# EAGLE design sma-test-20190912a (EAGLE 9.5.0)
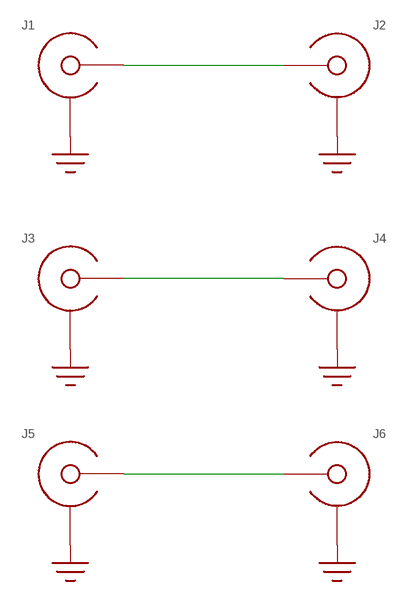
[diagram p0: schematic, sheet 1]

## Parts
J1  SMA-EDGE-LAUNCH4020N  [SMA_EDGE_LAUNCH_4L_4020_N]
J2  SMA-EDGE-LAUNCH4020N1  [SMA_EDGE_LAUNCH_4L_4020_N1]
J3  SMA-EDGE-LAUNCH4020N2  [SMA_EDGE_LAUNCH_4L_4020_N2]
J4  SMA-EDGE-LAUNCH4020N3  [SMA_EDGE_LAUNCH_4L_4020_N3]
J5  SMA-EDGE-LAUNCH4020N4  [SMA_EDGE_LAUNCH_4L_4020_N4]
J6  SMA-EDGE-LAUNCH4L-4020-TAPER-FIXED  [SMA_EDGE_LAUNCH_4L_4020_TAPER_FIXED]

## Nets
GND: J1.BOTTOM_GND(SHIELD) J1.GND@1(SHIELD) J1.GND@2(SHIELD) J1.GND@3(SHIELD) J1.GND@4(SHIELD) J1.GND@5(SHIELD) J1.GND@6(SHIELD) J1.GND@7(SHIELD) J1.GND@8(SHIELD) J1.GND@14(SHIELD) J1.GND@15(SHIELD) J1.GND@16(SHIELD) J1.GND@17(SHIELD) J1.GND_PAD1(SHIELD) J1.GND_PAD2(SHIELD) J1.P$1(SHIELD) J1.P$2(SHIELD) J2.BOTTOM_GND(SHIELD) J2.GND@1(SHIELD) J2.GND@2(SHIELD) J2.GND@3(SHIELD) J2.GND@4(SHIELD) J2.GND@5(SHIELD) J2.GND@6(SHIELD) J2.GND@7(SHIELD) J2.GND@8(SHIELD) J2.GND@14(SHIELD) J2.GND@15(SHIELD) J2.GND@16(SHIELD) J2.GND@17(SHIELD) J2.GND_PAD1(SHIELD) J2.GND_PAD2(SHIELD) J2.P$1(SHIELD) J2.P$2(SHIELD) J2.P$3(SHIELD) J2.P$4(SHIELD) J2.P$5(SHIELD) J3.BOTTOM_GND(SHIELD) J3.GND@1(SHIELD) J3.GND@2(SHIELD) J3.GND@3(SHIELD) J3.GND@4(SHIELD) J3.GND@5(SHIELD) J3.GND@6(SHIELD) J3.GND@7(SHIELD) J3.GND@8(SHIELD) J3.GND@14(SHIELD) J3.GND@15(SHIELD) J3.GND@16(SHIELD) J3.GND@17(SHIELD) J3.GND_PAD1(SHIELD) J3.GND_PAD2(SHIELD) J3.P$1(SHIELD) J3.P$2(SHIELD) J4.BOTTOM_GND(SHIELD) J4.GND@1(SHIELD) J4.GND@2(SHIELD) J4.GND@3(SHIELD) J4.GND@4(SHIELD) J4.GND@5(SHIELD) J4.GND@6(SHIELD) J4.GND@7(SHIELD) J4.GND@8(SHIELD) J4.GND@14(SHIELD) J4.GND@15(SHIELD) J4.GND@16(SHIELD) J4.GND@17(SHIELD) J4.GND_PAD1(SHIELD) J4.GND_PAD2(SHIELD) J4.P$1(SHIELD) J4.P$2(SHIELD) J4.P$3(SHIELD) J4.P$4(SHIELD) J5.BOTTOM_GND(SHIELD) J5.GND@1(SHIELD) J5.GND@2(SHIELD) J5.GND@3(SHIELD) J5.GND@4(SHIELD) J5.GND@5(SHIELD) J5.GND@6(SHIELD) J5.GND@7(SHIELD) J5.GND@8(SHIELD) J5.GND@9(SHIELD) J5.GND@10(SHIELD) J5.GND@14(SHIELD) J5.GND@15(SHIELD) J5.GND@16(SHIELD) J5.GND@17(SHIELD) J5.GND_PAD1(SHIELD) J5.GND_PAD2(SHIELD) J5.P$1(SHIELD) J5.P$2(SHIELD) J5.P$3(SHIELD) J5.P$4(SHIELD) J5.P$5(SHIELD) J6.BOTTOM_GND(SHIELD) J6.GND@1(SHIELD) J6.GND@2(SHIELD) J6.GND@3(SHIELD) J6.GND@4(SHIELD) J6.GND@5(SHIELD) J6.GND@6(SHIELD) J6.GND@7(SHIELD) J6.GND@8(SHIELD) J6.GND@14(SHIELD) J6.GND@15(SHIELD) J6.GND@16(SHIELD) J6.GND@17(SHIELD) J6.GND_PAD1(SHIELD) J6.GND_PAD2(SHIELD) J6.P$1(SHIELD) J6.P$2(SHIELD)
N$1 [13.4-6]: J1.CENTER@1(CENTER) J1.CENTER@2(CENTER) J2.CENTER@1(CENTER) J2.CENTER@2(CENTER)
N$2 [13.4-6]: J3.CENTER@1(CENTER) J3.CENTER@2(CENTER) J4.CENTER@1(CENTER) J4.CENTER@2(CENTER)
N$3 [13.4-6]: J5.CENTER@1(CENTER) J5.CENTER@2(CENTER) J6.CENTER@1(CENTER) J6.P$3(CENTER)

## Library data of the parts
J1-J6 = sma-temp:SMA-EDGE-LAUNCH

## Net classes
1 13.4-6: width 0.34 mm, clearance 0.152 mm

## Board
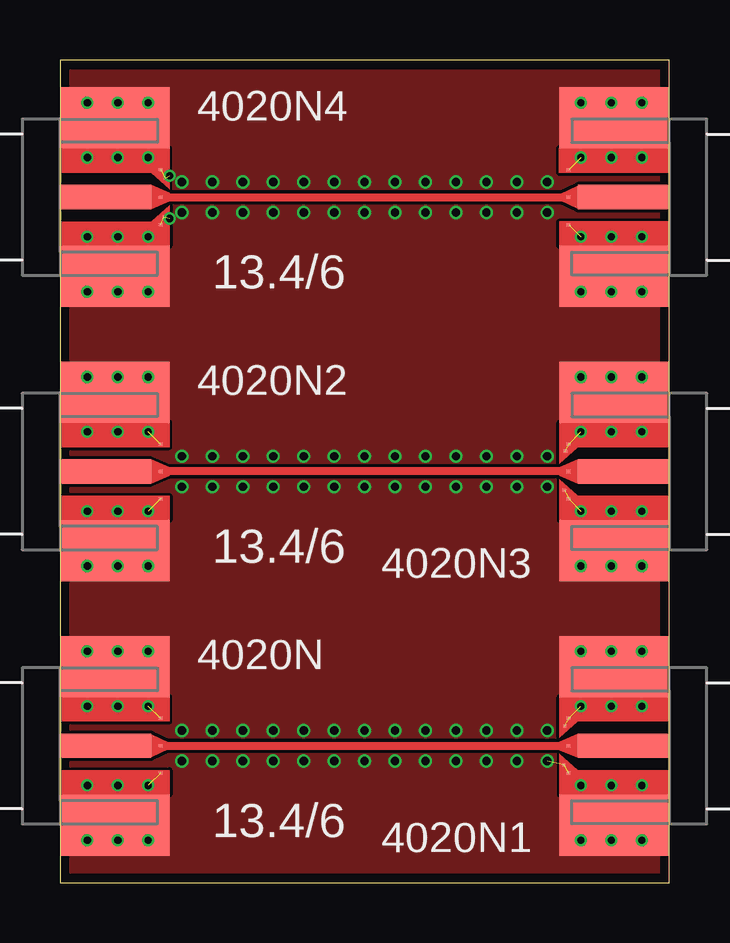
[diagram p1: board, top side]
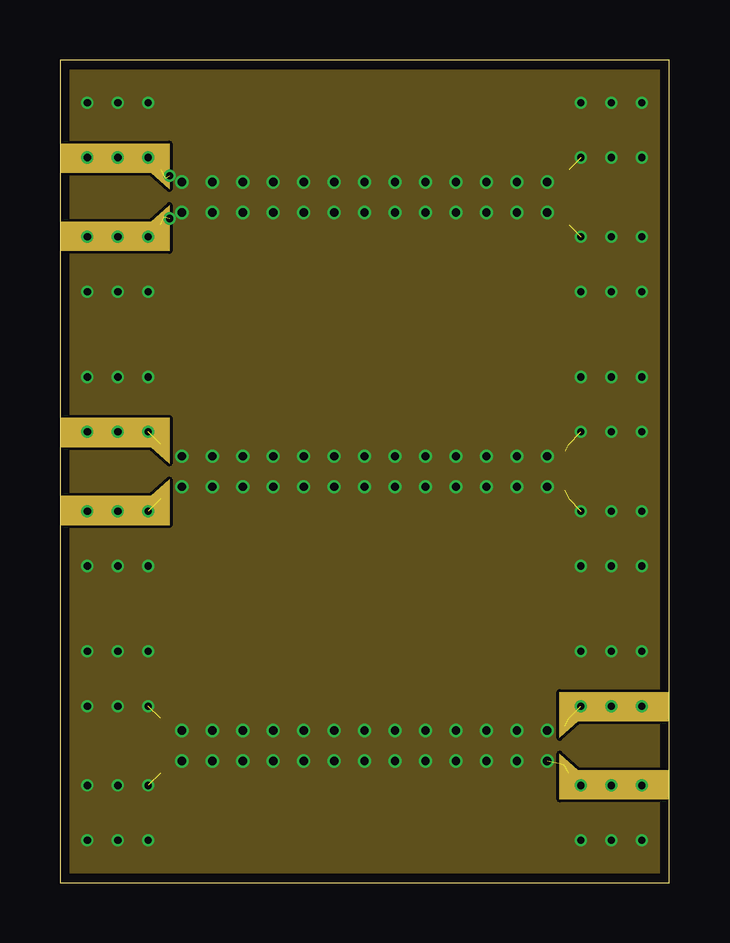
[diagram p2: board, inner layer Route2]
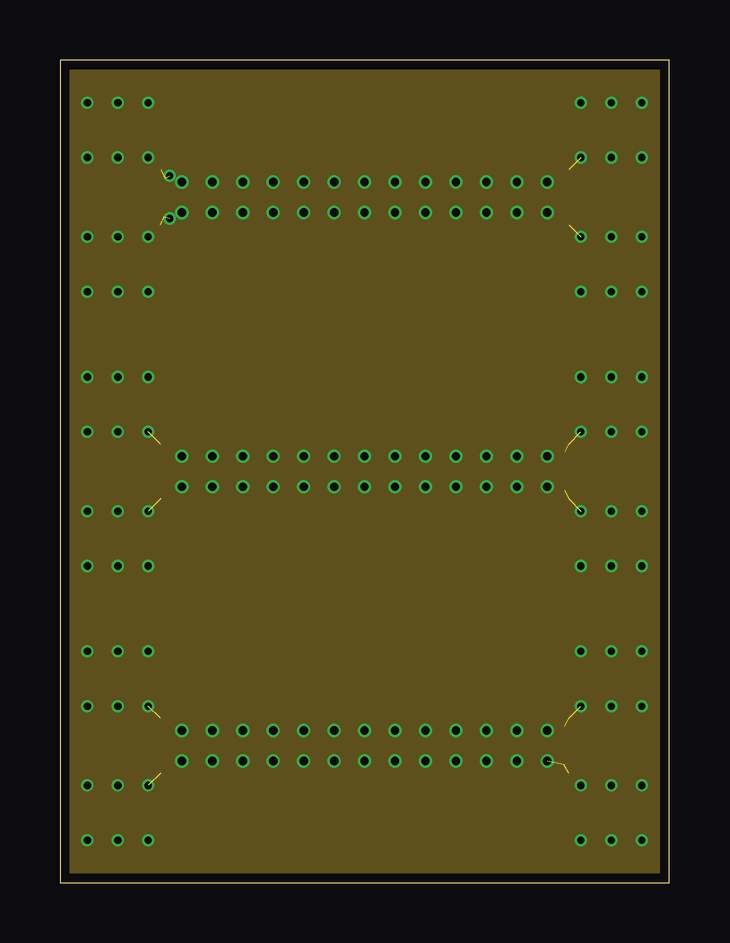
[diagram p3: board, inner layer Route15]
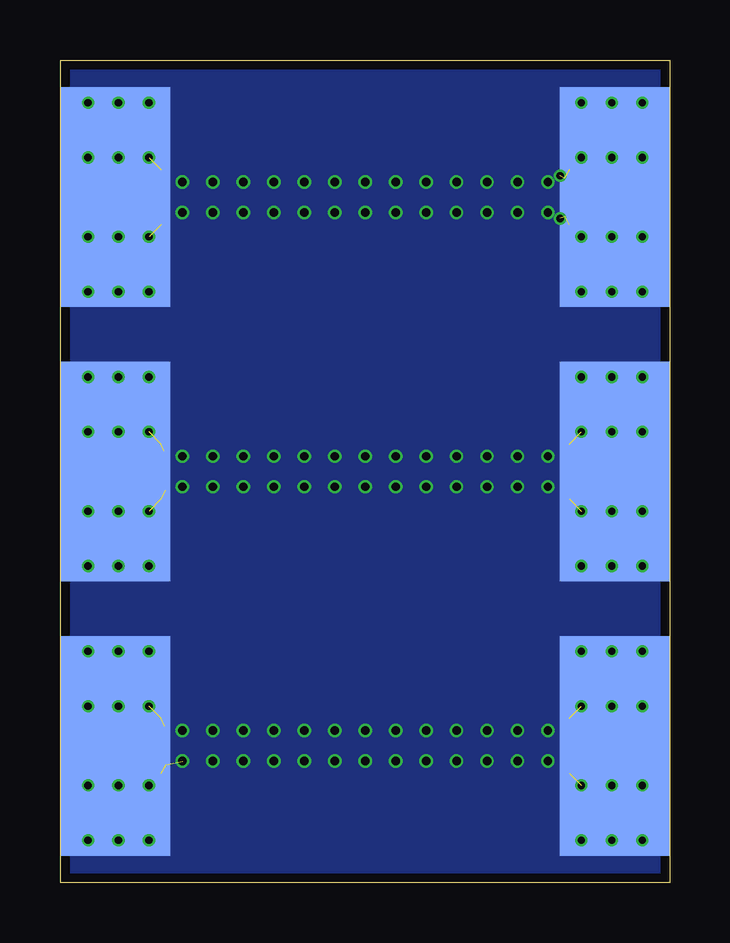
[diagram p4: board, bottom side, seen from below]

Size 25.4 x 34.29 mm. Coordinates in mm from the lower left corner, seen from the top.
Outline: 0,0 25.4,0 25.4,34.29 0,34.29 0,0
Copper layers (1*2*15*16): Top 0.035559375mm / dielectric 0.17018125mm / Route2 0.01778125mm / dielectric 47mil / Route15 0.01778125mm / dielectric 0.17018125mm / Bottom 0.035559375mm
Design rules "oshpark-4layer *": minimum track width 5mil, minimum drill 10mil, track to track 5mil, track to pad 5mil, pad to pad 5mil, via to via 5mil, smd to smd 5mil, copper to edge 15mil, drill to drill 6mil, minimum pad ring 4mil, minimum via ring 4mil, stop-mask expansion 2.5mil, vias tented up to drill 20mil, thermal gap 10mil

### Footprints (pad centres in the part's own frame; a part is rotated, then mirrored left to right if it is on the bottom)
SMA_EDGE_LAUNCH_4L_4020_N = smd 4.572 x 9.144 bottom: BOTTOM_GND 2.286,0 | smd 3.81 x 1.016: CENTER@1 1.905,0 | smd 0.127 x 0.127: CENTER@2 4.191,0; P$1 4.191,1.143; P$2 4.191,-1.143 | drill 0.3: GND@1 1.143,3.937; GND@2 3.683,3.937; GND@3 1.143,1.651; GND@4 3.683,1.651; GND@5 1.143,-1.651; GND@6 3.683,-1.651; GND@7 1.143,-3.937; GND@8 3.683,-3.937; GND@14 2.413,3.937; GND@15 2.413,-3.937; GND@16 2.413,-1.651; GND@17 2.413,1.651 | smd 4.572 x 2.54: GND_PAD1 2.286,3.302; GND_PAD2 2.286,-3.302
SMA_EDGE_LAUNCH_4L_4020_N1 = smd 4.572 x 9.144 bottom: BOTTOM_GND 2.286,0 | smd 3.81 x 1.016: CENTER@1 1.905,0 | smd 0.127 x 0.127: CENTER@2 4.191,0; P$1 4.191,1.143; P$2 4.191,-1.143; P$3 4.191,1.143; P$4 4.394,0.787; P$5 4.343,-0.813 | drill 0.3: GND@1 1.143,3.937; GND@2 3.683,3.937; GND@3 1.143,1.651; GND@4 3.683,1.651; GND@5 1.143,-1.651; GND@6 3.683,-1.651; GND@7 1.143,-3.937; GND@8 3.683,-3.937; GND@14 2.413,3.937; GND@15 2.413,-3.937; GND@16 2.413,-1.651; GND@17 2.413,1.651 | smd 4.572 x 2.54: GND_PAD1 2.286,3.302; GND_PAD2 2.286,-3.302
SMA_EDGE_LAUNCH_4L_4020_N2 = smd 4.572 x 9.144 bottom: BOTTOM_GND 2.286,0 | smd 3.81 x 1.016: CENTER@1 1.905,0 | smd 0.127 x 0.127: CENTER@2 4.191,0; P$1 4.191,1.143; P$2 4.191,-1.143 | drill 0.3: GND@1 1.143,3.937; GND@2 3.683,3.937; GND@3 1.143,1.651; GND@4 3.683,1.651; GND@5 1.143,-1.651; GND@6 3.683,-1.651; GND@7 1.143,-3.937; GND@8 3.683,-3.937; GND@14 2.413,3.937; GND@15 2.413,-3.937; GND@16 2.413,-1.651; GND@17 2.413,1.651 | smd 4.572 x 2.54: GND_PAD1 2.286,3.302; GND_PAD2 2.286,-3.302
SMA_EDGE_LAUNCH_4L_4020_N3 = smd 4.572 x 9.144 bottom: BOTTOM_GND 2.286,0 | smd 3.81 x 1.016: CENTER@1 1.905,0 | smd 0.127 x 0.127: CENTER@2 4.191,0; P$1 4.191,1.143; P$2 4.191,-1.143; P$3 4.369,0.787; P$4 4.318,-0.838 | drill 0.3: GND@1 1.143,3.937; GND@2 3.683,3.937; GND@3 1.143,1.651; GND@4 3.683,1.651; GND@5 1.143,-1.651; GND@6 3.683,-1.651; GND@7 1.143,-3.937; GND@8 3.683,-3.937; GND@14 2.413,3.937; GND@15 2.413,-3.937; GND@16 2.413,-1.651; GND@17 2.413,1.651 | smd 4.572 x 2.54: GND_PAD1 2.286,3.302; GND_PAD2 2.286,-3.302
SMA_EDGE_LAUNCH_4L_4020_N4 = smd 4.572 x 9.144 bottom: BOTTOM_GND 2.286,0 | smd 3.81 x 1.016: CENTER@1 1.905,0 | smd 0.127 x 0.127: CENTER@2 4.191,0; P$1 4.191,1.143; P$2 4.191,-1.143; P$3 4.191,1.143; P$4 4.394,0.787; P$5 4.343,-0.813 | drill 0.3: GND@1 1.143,3.937; GND@2 3.683,3.937; GND@3 1.143,1.651; GND@4 3.683,1.651; GND@5 1.143,-1.651; GND@6 3.683,-1.651; GND@7 1.143,-3.937; GND@8 3.683,-3.937; GND@9 4.572,0.889; GND@10 4.572,-0.889; GND@14 2.413,3.937; GND@15 2.413,-3.937; GND@16 2.413,-1.651; GND@17 2.413,1.651 | smd 4.572 x 2.54: GND_PAD1 2.286,3.302; GND_PAD2 2.286,-3.302
SMA_EDGE_LAUNCH_4L_4020_TAPER_FIXED = smd 4.572 x 9.144 bottom: BOTTOM_GND 2.286,0 | smd 3.81 x 1.016: CENTER@1 1.905,0 | drill 0.3: GND@1 1.143,3.937; GND@2 3.683,3.937; GND@3 1.143,1.651; GND@4 3.683,1.651; GND@5 1.143,-1.651; GND@6 3.683,-1.651; GND@7 1.143,-3.937; GND@8 3.683,-3.937; GND@14 2.413,3.937; GND@15 2.413,-3.937; GND@16 2.413,-1.651; GND@17 2.413,1.651 | smd 4.572 x 2.54: GND_PAD1 2.286,3.302; GND_PAD2 2.286,-3.302 | smd 0.127 x 0.127: P$1 4.191,1.143; P$2 4.191,-1.143; P$3 4.191,0

### Placement (x,y rotation side)
J1  0,5.71 0 top
J2  25.4,5.71 180 top
J3  0,17.14 0 top
J4  25.4,17.14 180 top
J5  0,28.57 0 top
J6  25.4,28.57 180 top

### Tracks (layer width: path | path; a pad name or v marks a point on that pad's centre or on a via)
GND  (via drill 0.35)  (18 unrouted)
  other vias: 5.08,17.78 6.35,17.78 7.62,17.78 8.89,17.78 10.16,17.78 11.43,17.78 12.7,17.78 13.97,17.78 15.24,17.78 16.51,17.78 17.78,17.78 19.05,17.78 20.32,17.78 5.08,16.51 6.35,16.51 7.62,16.51 8.89,16.51 10.16,16.51 11.43,16.51 12.7,16.51 13.97,16.51 15.24,16.51 16.51,16.51 17.78,16.51 19.05,16.51 20.32,16.51 5.08,6.35 6.35,6.35 7.62,6.35 8.89,6.35 10.16,6.35 11.43,6.35 12.7,6.35 13.97,6.35 15.24,6.35 16.51,6.35 17.78,6.35 19.05,6.35 20.32,6.35 5.08,5.08 6.35,5.08 7.62,5.08 8.89,5.08 10.16,5.08 11.43,5.08 12.7,5.08 13.97,5.08 15.24,5.08 16.51,5.08 17.78,5.08 19.05,5.08 20.32,5.08 5.08,29.21 6.35,29.21 7.62,29.21 8.89,29.21 10.16,29.21 11.43,29.21 12.7,29.21 13.97,29.21 15.24,29.21 16.51,29.21 17.78,29.21 19.05,29.21 20.32,29.21 5.08,27.94 6.35,27.94 7.62,27.94 8.89,27.94 10.16,27.94 11.43,27.94 12.7,27.94 13.97,27.94 15.24,27.94 16.51,27.94 17.78,27.94 19.05,27.94 20.32,27.94
  pour Top (no thermals): 0,0 25.4,0 25.4,34.29 0,34.29
  pour Route2 (no thermals): 0,0 25.4,0 25.4,34.29 0,34.29
  pour Route15 (no thermals): 0,0 25.4,0 25.4,34.29 0,34.29
  pour Bottom (no thermals): 0,0 25.4,0 25.4,34.29 0,34.29
N$1
  Top 0.34: J1.CENTER@2 J1.CENTER@1 J2.CENTER@2 J2.CENTER@1
N$2
  Top 0.34: J4.CENTER@1 J4.CENTER@2 J3.CENTER@2 J3.CENTER@1
N$3
  Top 0.34: J5.CENTER@1 J5.CENTER@2 J6.P$3 J6.CENTER@1

### Text on the board
tPlace: 13.4/6 | 13.4/6 | 13.4/6